# Altium project PCB_Project.PrjPcb
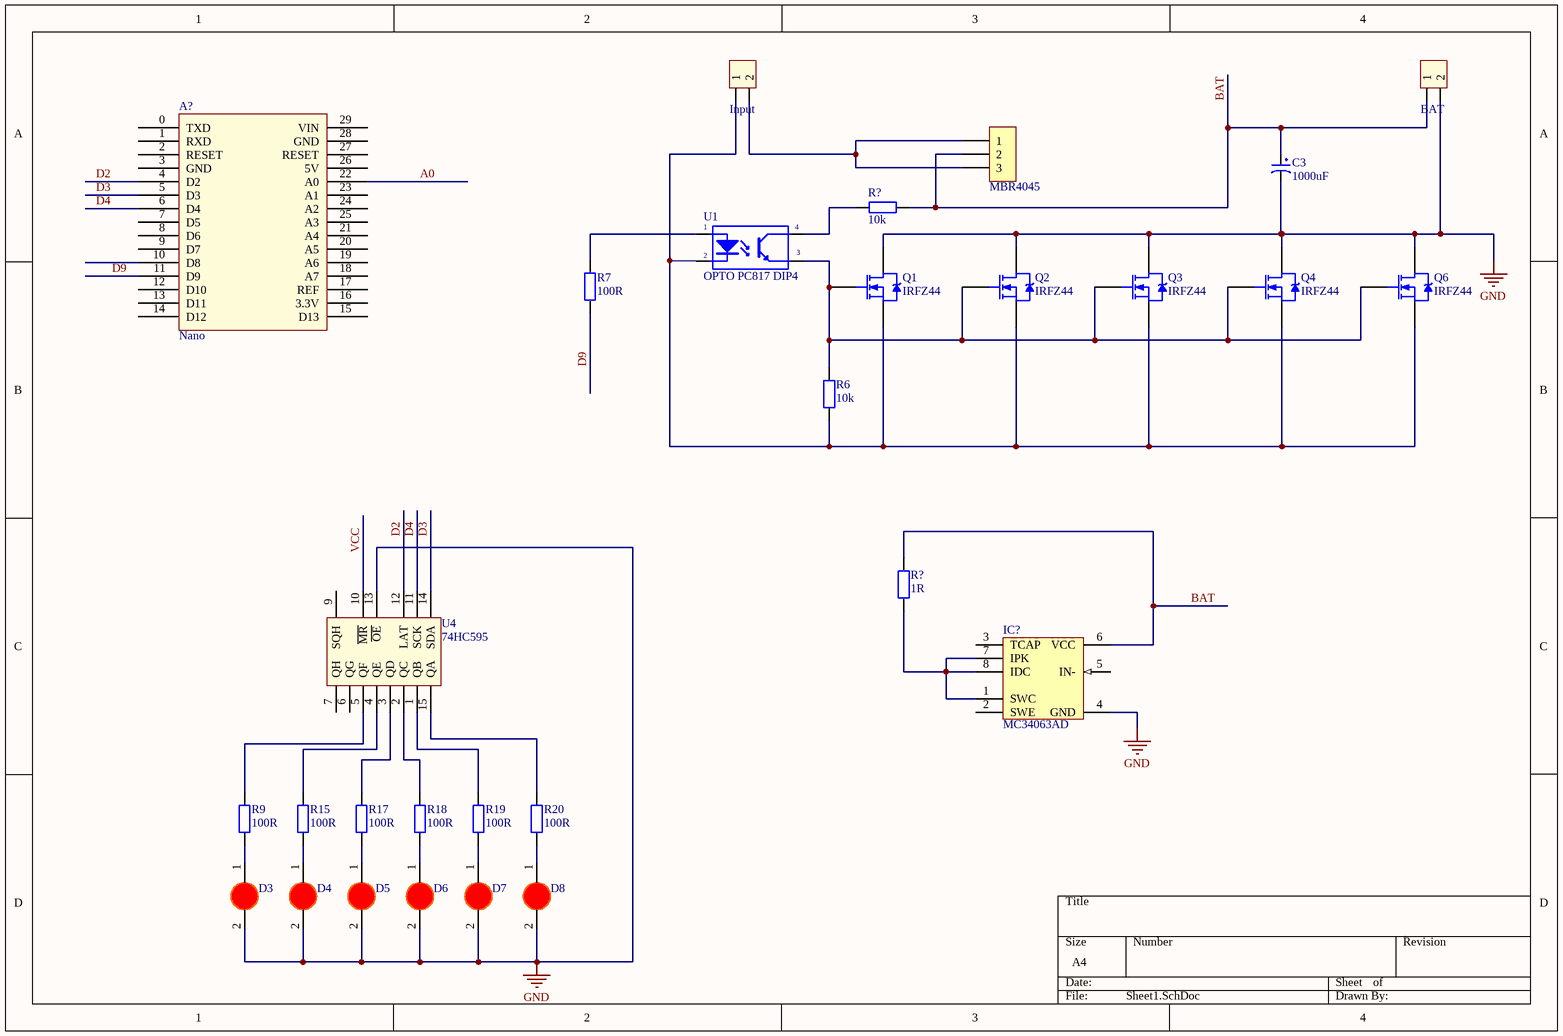
[diagram p0: Sheet1.SchDoc]
1 sheet, 29 parts. Net scope: global (net labels, ports and power ports of the same name join across sheets).

## Sheet Sheet1.SchDoc
size A4

### Parts
(Parts that share a designator on the sheet are numbered #1, #2 ... from top to bottom, then left to right.)
A?  Nano  [Arduino nano]
BAT  BAT  [XH2.54M-2]
C3  1000uF  [tu hoa 13mm]
D3  LED 3mm  [LED-3MM-RED]  (value not drawn)
D4  LED 3mm  [LED-3MM-RED]  (value not drawn)
D5  LED 3mm  [LED-3MM-RED]  (value not drawn)
D6  LED 3mm  [LED-3MM-RED]  (value not drawn)
D7  LED 3mm  [LED-3MM-RED]  (value not drawn)
D8  LED 3mm  [LED-3MM-RED]  (value not drawn)
H?  MBR4045  [XH2.54M-3]
IC?  MC34063AD  [DIP8/W0.3]
Input  Input  [Header 2P DC 2.54]
Q1  IRFZ44  [TO220]
Q2  IRFZ44  [TO220]
Q3  IRFZ44  [TO220]
Q4  IRFZ44  [TO220]
Q6  IRFZ44  [TO220]
R6  10k  [tro vach 1w]
R7  100R  [tro vach 2w]
R9  100R  [tro vach 1w]
R15  100R  [tro vach 1w]
R17  100R  [tro vach 1w]
R18  100R  [tro vach 1w]
R19  100R  [tro vach 1w]
R20  100R  [tro vach 1w]
R?#1  10k  [tro vach 1w]
R?#2  1R  [tro vach 2w]
U1  OPTO PC817 DIP4  [DIP4]
U4  74HC595  [DIP16/W0.3]

### Nets
GND: BAT.2 C3.2 D3.2(K) D4.2(K) D5.2(K) D6.2(K) D7.2(K) D8.2(K) IC?.4(GND) Q1.2(D) Q2.2(D) Q3.2(D) Q4.2(D) Q6.2(D) U4.8(GND) U4.13(~{OE})
VCC: U4.10(~{MR}) U4.16(VCC)
A0: A?.22(A0)
BAT: BAT.1 C3.1 H?.2 IC?.6(VCC) R?#1.2 R?#2.2
D2: A?.4(D2) U4.12(LAT)
D3: A?.5(D3) U4.14(SDA)
D4: A?.6(D4) U4.11(SCK)
D9: A?.11(D9) R7.1
NetD3_1: D3.1(A) R9.1
NetD4_1: D4.1(A) R15.1
NetD5_1: D5.1(A) R17.1
NetD6_1: D6.1(A) R18.1
NetD7_1: D7.1(A) R19.1
NetD8_1: D8.1(A) R20.1
NetH?_1: H?.1 H?.3 Input.2
NetIC?_1: IC?.1(SWC) IC?.7(IPK) IC?.8(IDC) R?#2.1
NetInput_1: Input.1 Q1.3(S) Q2.3(S) Q3.3(S) Q4.3(S) Q6.3(S) R6.1 U1.2(K)
NetQ1_1: Q1.1(G) Q2.1(G) Q3.1(G) Q4.1(G) Q6.1(G) R6.2 U1.3(E)
NetR7_2: R7.2 U1.1(A)
NetR9_2: R9.2 U4.5(QF)
NetR15_2: R15.2 U4.4(QE)
NetR17_2: R17.2 U4.3(QD)
NetR18_2: R18.2 U4.2(QC)
NetR19_2: R19.2 U4.1(QB)
NetR20_2: R20.2 U4.15(QA)
NetR?#1_1: R?#1.1 U1.4(C)

Not connected (* = marked no-connect by the designer): A? 0(TXD) 1(RXD) 2(RESET) 3(GND) 7(D5) 8(D6) 9(D7) 10(D8) 12(D10) 13(D11) 14(D12) 15(D13) 16(3.3V) 17(REF) 18(A7) 19(A6) 20(A5) 21(A4) 23(A1) 24(A2) 25(A3) 26(5V) 27(RESET) 28(GND) 29(VIN); IC? 2(SWE) 3(TCAP) 5(IN-); U4 6(QG) 7(QH) 9(SQH)

### Library data of the parts
A? = Arduino Nano
BAT = Header 2P 2.54 Duc Thang: Cắm; Ten_Linh_Kien: Header 2P XH2.54-2P Đực Thẳng; Don_Vi: Con; Ma_Hang: MH001283; Chung_Loai: Cắm
C3 = Tu Hoa 1000uF 50V 13x26: Cắm; Don_Vi: Con; So_Chan: 2; Ten_Linh_Kien: Tụ Hóa 1000uF 50V; Ma_Hang: MH006619; Chung_Loai: Cắm; Kieu_Chan: *
D3-D8 = LED 3mm Do: Cắm; Don_Vi: Con; Ma_Hang: MH003892; Ten_Linh_Kien: Led 3MM Phủ Đỏ (10c); Ghi_Chu: *; Kieu_Chan: *; Chung_Loai: Cắm
H? = Header 3P 2.54 Duc Thang: Cắm; Ten_Linh_Kien: Header 3P XH2.54-3P Đực Thẳng; Don_Vi: Con; Ma_Hang: MH001292; Chung_Loai: Cắm
IC? = MC34063AD: DC-to-DC Converter Control Circuit; Published: 15-Apr-2002; LatestRevisionDate: 13-Apr-2006; LatestRevisionNote: IPC-7351 Footprint Added.; DatasheetVersion: 1996; PackageVersion: 1998; PackageReference: 751-05; Publisher: Altium Limited; PackageDescription: 8-Pin Small Outline Integrated Circuit 1.27 mm Pitch; Code_JEDEC: MS-012-AA; Code_IPC: SOIC127P600-8; ComponentLink1Description: Manufacturer Link; ComponentLink1URL: http://www.onsemi.com/site/products/taxonomy/0,4438,503,00.html; ComponentLink2Description: Datasheet; ComponentLink2URL: http://www.onsemi.com/pub/Collateral/MC34063A-D.PDF
Input = Header 2P 2.54 Duc Cong: Cắm; Ten_Linh_Kien: Header 2P XH2.54-2P Đực Cong; Don_Vi: Con; Ma_Hang: MH002852; Chung_Loai: Cắm
Q1-Q4 Q6 = IRFZ44 DIP: N-Channel Power MOSFET
R6 R?#1 = Tro Vach 1W 5% 10k: Cắm; Don_Vi: Con; So_Chan: 2; Ten_Linh_Kien: Trở 5% 1w 10k; Ma_Hang: MH006391; Chung_Loai: Cắm; Kieu_Chan: *
R7 = Tro Vach 2W 5% 100R: Cắm; Don_Vi: Con; So_Chan: 2; Ten_Linh_Kien: Trở 5% 2w 100R; Ma_Hang: MH006357; Chung_Loai: Cắm; Kieu_Chan: *
R9 R15 R17-R20 = Tro Vach 1W 5% 100R: Cắm; Don_Vi: Con; So_Chan: 2; Ten_Linh_Kien: Trở 5% 1w 100R; Ma_Hang: MH006390; Chung_Loai: Cắm; Kieu_Chan: *
R?#2 = Tro Vach 2W 5% 1R: Cắm; Don_Vi: Con; So_Chan: 2; Ten_Linh_Kien: Trở 5% 2w 1R; Ma_Hang: MH006366; Chung_Loai: Cắm; Kieu_Chan: *
U1 = OPTO PC817 DIP4: Single Opto; Value: PC817
U4 = 74595: 8 Bit Serial input - Parallel Output; Value: 74HC595